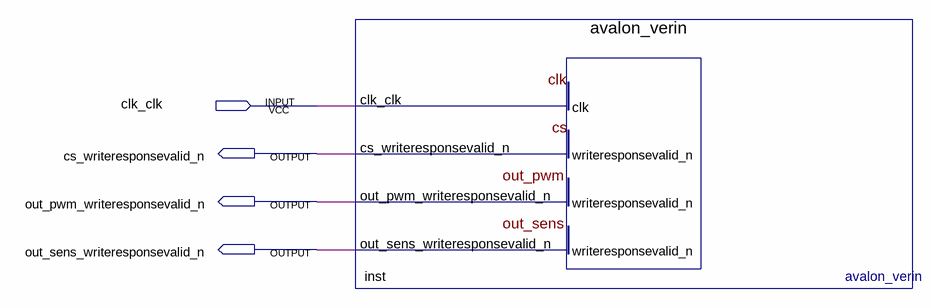
[diagram p0: schematic sheet]
// Quartus schematic Block2.bdf as structural Verilog: 1 symbols, 4 pins
module Block2 (
  input  clk_clk,
  output cs_writeresponsevalid_n,
  output out_pwm_writeresponsevalid_n,
  output out_sens_writeresponsevalid_n
);

  avalon_verin inst (
    .clk_clk(clk_clk), .cs_writeresponsevalid_n(cs_writeresponsevalid_n),
    .out_pwm_writeresponsevalid_n(out_pwm_writeresponsevalid_n),
    .out_sens_writeresponsevalid_n(out_sens_writeresponsevalid_n));
endmodule
